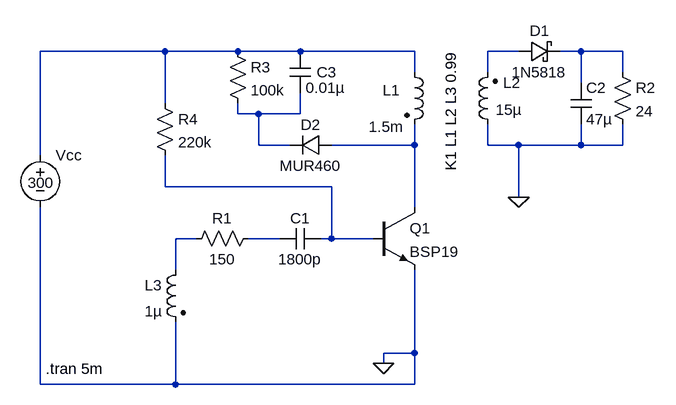
[diagram p0: schematic 1QHighVin.asc]
1QHighVin.asc, the LTspice schematic file:
Version 4
SHEET 1 880 680
WIRE -176 0 -368 0
WIRE -64 0 -176 0
WIRE 32 0 -64 0
WIRE 208 0 32 0
WIRE 368 0 320 0
WIRE 464 0 432 0
WIRE 528 0 464 0
WIRE 208 32 208 0
WIRE 320 32 320 0
WIRE 528 32 528 0
WIRE 464 48 464 0
WIRE -176 80 -176 0
WIRE -64 96 -64 80
WIRE -32 96 -64 96
WIRE 32 96 32 64
WIRE 32 96 -32 96
WIRE -32 144 -32 96
WIRE 16 144 -32 144
WIRE 208 144 208 112
WIRE 208 144 80 144
WIRE 320 144 320 112
WIRE 368 144 320 144
WIRE 464 144 464 112
WIRE 464 144 368 144
WIRE 528 144 528 112
WIRE 528 144 464 144
WIRE -368 160 -368 0
WIRE -176 208 -176 160
WIRE 80 208 -176 208
WIRE 368 224 368 144
WIRE 208 240 208 144
WIRE -128 288 -160 288
WIRE 0 288 -48 288
WIRE 80 288 80 208
WIRE 80 288 64 288
WIRE 144 288 80 288
WIRE -160 336 -160 288
WIRE 208 464 208 336
WIRE 208 464 160 464
WIRE 160 480 160 464
WIRE -368 512 -368 240
WIRE -160 512 -160 416
WIRE -160 512 -368 512
WIRE 208 512 208 464
WIRE 208 512 -160 512
FLAG 368 224 0
FLAG 160 480 0
SYMBOL npn 144 240 R0
SYMATTR InstName Q1
SYMATTR Value BSP19
SYMBOL ind2 192 16 R0
WINDOW 0 -33 44 Left 0
WINDOW 3 -55 100 Left 0
SYMATTR InstName L1
SYMATTR Value 1.5m
SYMATTR Type ind
SYMBOL ind2 336 128 R180
WINDOW 0 -35 80 Left 0
WINDOW 3 -37 38 Left 0
SYMATTR InstName L2
SYMATTR Value 15µ
SYMATTR Type ind
SYMBOL ind2 -144 320 M0
SYMATTR InstName L3
SYMATTR Value 1µ
SYMATTR Type ind
SYMBOL cap 64 272 R90
WINDOW 0 0 32 VBottom 0
WINDOW 3 32 32 VTop 0
SYMATTR InstName C1
SYMATTR Value 1800p
SYMBOL res -32 272 R90
WINDOW 0 0 56 VBottom 0
WINDOW 3 32 56 VTop 0
SYMATTR InstName R1
SYMATTR Value 150
SYMBOL schottky 368 16 R270
WINDOW 0 32 32 VTop 0
WINDOW 3 0 32 VBottom 0
SYMATTR InstName D1
SYMATTR Value 1N5818
SYMATTR Description Diode
SYMATTR Type diode
SYMBOL cap 448 48 R0
SYMATTR InstName C2
SYMATTR Value 47µ
SYMBOL res 512 16 R0
SYMATTR InstName R2
SYMATTR Value 24
SYMBOL res -80 -16 R0
SYMATTR InstName R3
SYMATTR Value 100k
SYMBOL cap 16 0 R0
WINDOW 0 41 32 Left 0
SYMATTR InstName C3
SYMATTR Value 0.01µ
SYMBOL diode 80 128 R90
WINDOW 0 0 32 VBottom 0
WINDOW 3 32 32 VTop 0
SYMATTR InstName D2
SYMATTR Value MUR460
SYMBOL res -192 64 R0
SYMATTR InstName R4
SYMATTR Value 220k
SYMBOL voltage -368 144 R0
WINDOW 3 -19 58 Left 0
SYMATTR InstName Vcc
SYMATTR Value 300
TEXT 264 0 VRight 0 !K1 L1 L2 L3 0.99
TEXT -360 488 Left 0 !.tran 5m

The netlist it stands for:
* 1QHighVin.asc
Q1 N005 N006 0 0 BSP19
L1 N001 N005 1.5m
L2 0 N002 15µ
L3 N007 0 1µ
C1 N006 N008 1800p
R1 N008 N007 150
D1 N002 N003 1N5818
C2 N003 0 47µ
R2 N003 0 24
R3 N001 N004 100k
C3 N001 N004 0.01µ
D2 N005 N004 MUR460
R4 N001 N006 220k
Vcc N001 0 300
.model D D
.lib standard.dio
.model NPN NPN
.model PNP PNP
.lib standard.bjt
K1 L1 L2 L3 0.99
.tran 5m
.backanno
.end